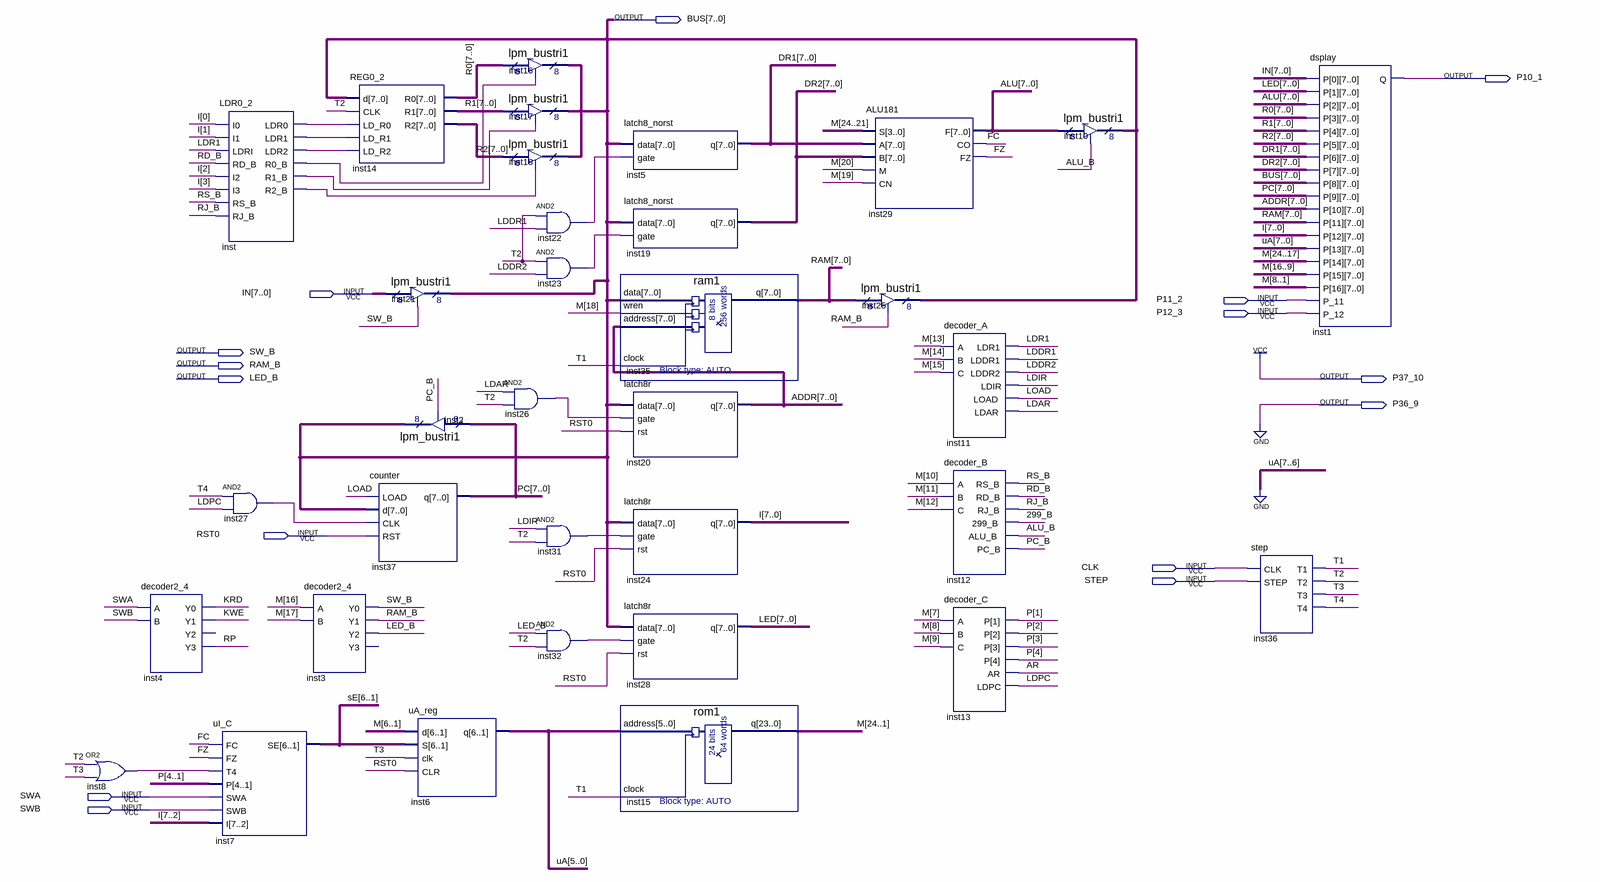
[diagram p0: schematic sheet]
// Quartus schematic Lab6.bdf as structural Verilog: 34 symbols, 15 pins
module Lab6 (
  input  [7:0] IN,
  input  P11_2,
  input  P12_3,
  input  RST0,
  input  CLK,
  input  STEP,
  input  SWA,
  input  SWB,
  output [7:0] BUS,
  output P10_1,
  output SW_B,
  output RAM_B,
  output LED_B,
  output P37_10,
  output P36_9
);

  wire \299_B , ALU_B, AR, FC, FZ, inst8_out, inst22_out, inst23_out, inst26_out, inst27_out, inst31_out,
       inst32_out, inst_ldr0, inst_ldr1, inst_ldr2, inst_r0_b, inst_r1_b, inst_r2_b, KRD, KWE, LDAR, LDDR1,
       LDDR2, LDIR, LDPC, LDR1, LOAD, PC_B, RD_B, RJ_B, RP, RS_B, T1, T2, T3, T4;
  wire [4:1] P;
  wire [5:0] uA;
  wire [6:1] sE;
  wire [7:0] ADDR, ALU, DR1, DR2, I, LED, PC, R0, R1, R2, RAM;
  wire [24:1] M;

  or inst8 (inst8_out, T2, T3);
  decoder2_4 inst4 (.A(SWA), .B(SWB), .Y0(KRD), .Y1(KWE), .Y3(RP));  // open: Y2
  LDR0_2 inst (
    .I0(I[0]), .I1(I[1]), .LDRI(LDR1), .RD_B(RD_B), .I2(I[2]), .I3(I[3]), .RS_B(RS_B), .RJ_B(RJ_B),
    .LDR0(inst_ldr0), .LDR1(inst_ldr1), .LDR2(inst_ldr2), .R0_B(inst_r0_b), .R1_B(inst_r1_b), .R2_B(inst_r2_b));
  and inst27 (inst27_out, T4, LDPC);
  uI_C inst7 (.FC(FC), .FZ(FZ), .T4(inst8_out), .P(P), .SWA(SWA), .SWB(SWB), .I(I[7:2]), .SE(sE));
  REG0_2 inst14 (.d(BUS), .CLK(T2), .LD_R0(inst_ldr0), .LD_R1(inst_ldr1), .LD_R2(inst_ldr2), .R0(R0), .R1(R1), .R2(R2));
  decoder2_4 inst3 (.A(M[16]), .B(M[17]), .Y0(SW_B), .Y1(RAM_B), .Y2(LED_B));  // open: Y3
  lpm_bustri1 inst21 (.enabledt(SW_B), .data(IN), .tridata(BUS));
  counter inst37 (.LOAD(LOAD), .d(BUS), .CLK(inst27_out), .RST(RST0), .q(PC));
  lpm_bustri1 inst2 (.enabledt(PC_B), .data(PC), .tridata(BUS));
  uA_reg inst6 (.d(M[6:1]), .S(sE), .clk(T3), .CLR(RST0), .q(uA));
  lpm_bustri1 inst16 (.enabledt(inst_r0_b), .data(R0), .tridata(BUS));
  lpm_bustri1 inst17 (.enabledt(inst_r1_b), .data(R1), .tridata(BUS));
  lpm_bustri1 inst18 (.enabledt(inst_r2_b), .data(R2), .tridata(BUS));
  and inst26 (inst26_out, LDAR, T2);
  and inst22 (inst22_out, T2, LDDR1);
  and inst23 (inst23_out, T2, LDDR2);
  and inst31 (inst31_out, LDIR, T2);
  and inst32 (inst32_out, LED_B, T2);
  latch8_norst inst5 (.data(BUS), .gate(inst22_out), .q(DR1));
  latch8_norst inst19 (.data(BUS), .gate(inst23_out), .q(DR2));
  ram1 inst35 (.data(BUS), .wren(M[18]), .address(ADDR), .clock(T1), .q(RAM));
  latch8r inst20 (.data(BUS), .gate(inst26_out), .rst(RST0), .q(ADDR));
  latch8r inst24 (.data(BUS), .gate(inst31_out), .rst(RST0), .q(I));
  latch8r inst28 (.data(BUS), .gate(inst32_out), .rst(RST0), .q(LED));
  rom1 inst15 (.address(uA), .clock(T1), .q(M));
  ALU181 inst29 (.S(M[24:21]), .A(DR1), .B(DR2), .M(M[20]), .CN(M[19]), .F(ALU), .CO(FC), .FZ(FZ));
  lpm_bustri1 inst25 (.enabledt(RAM_B), .data(RAM), .tridata(BUS));
  decoder_A inst11 (
    .A(M[13]), .B(M[14]), .C(M[15]), .LDR1(LDR1), .LDDR1(LDDR1), .LDDR2(LDDR2), .LDIR(LDIR), .LOAD(LOAD),
    .LDAR(LDAR));
  decoder_B inst12 (
    .A(M[10]), .B(M[11]), .C(M[12]), .RS_B(RS_B), .RD_B(RD_B), .RJ_B(RJ_B), .\299_B (\299_B ), .ALU_B(ALU_B),
    .PC_B(PC_B));
  decoder_C inst13 (.A(M[7]), .B(M[8]), .C(M[9]), .P(P), .AR(AR), .LDPC(LDPC));
  lpm_bustri1 inst10 (.enabledt(ALU_B), .data(ALU), .tridata(BUS));
  step inst36 (.CLK(CLK), .STEP(STEP), .T1(T1), .T2(T2), .T3(T3), .T4(T4));
  dsplay inst1 (
    .P_0(IN), .P_1(LED), .P_2(ALU), .P_3(R0), .P_4(R1), .P_5(R2), .P_6(DR1), .P_7(DR2), .P_8(BUS), .P_9(PC),
    .P_10(ADDR), .P_11({RAM, P11_2}), .P_12({I, P12_3}), .P_13({2'b00, uA}), .P_14(M[24:17]), .P_15(M[16:9]),
    .P_16(M[8:1]), .Q(P10_1));

  assign P36_9 = 1'b0;
  assign P37_10 = 1'b1;
endmodule
